# EAGLE design LightSwitch-USB (EAGLE 8.1.0)
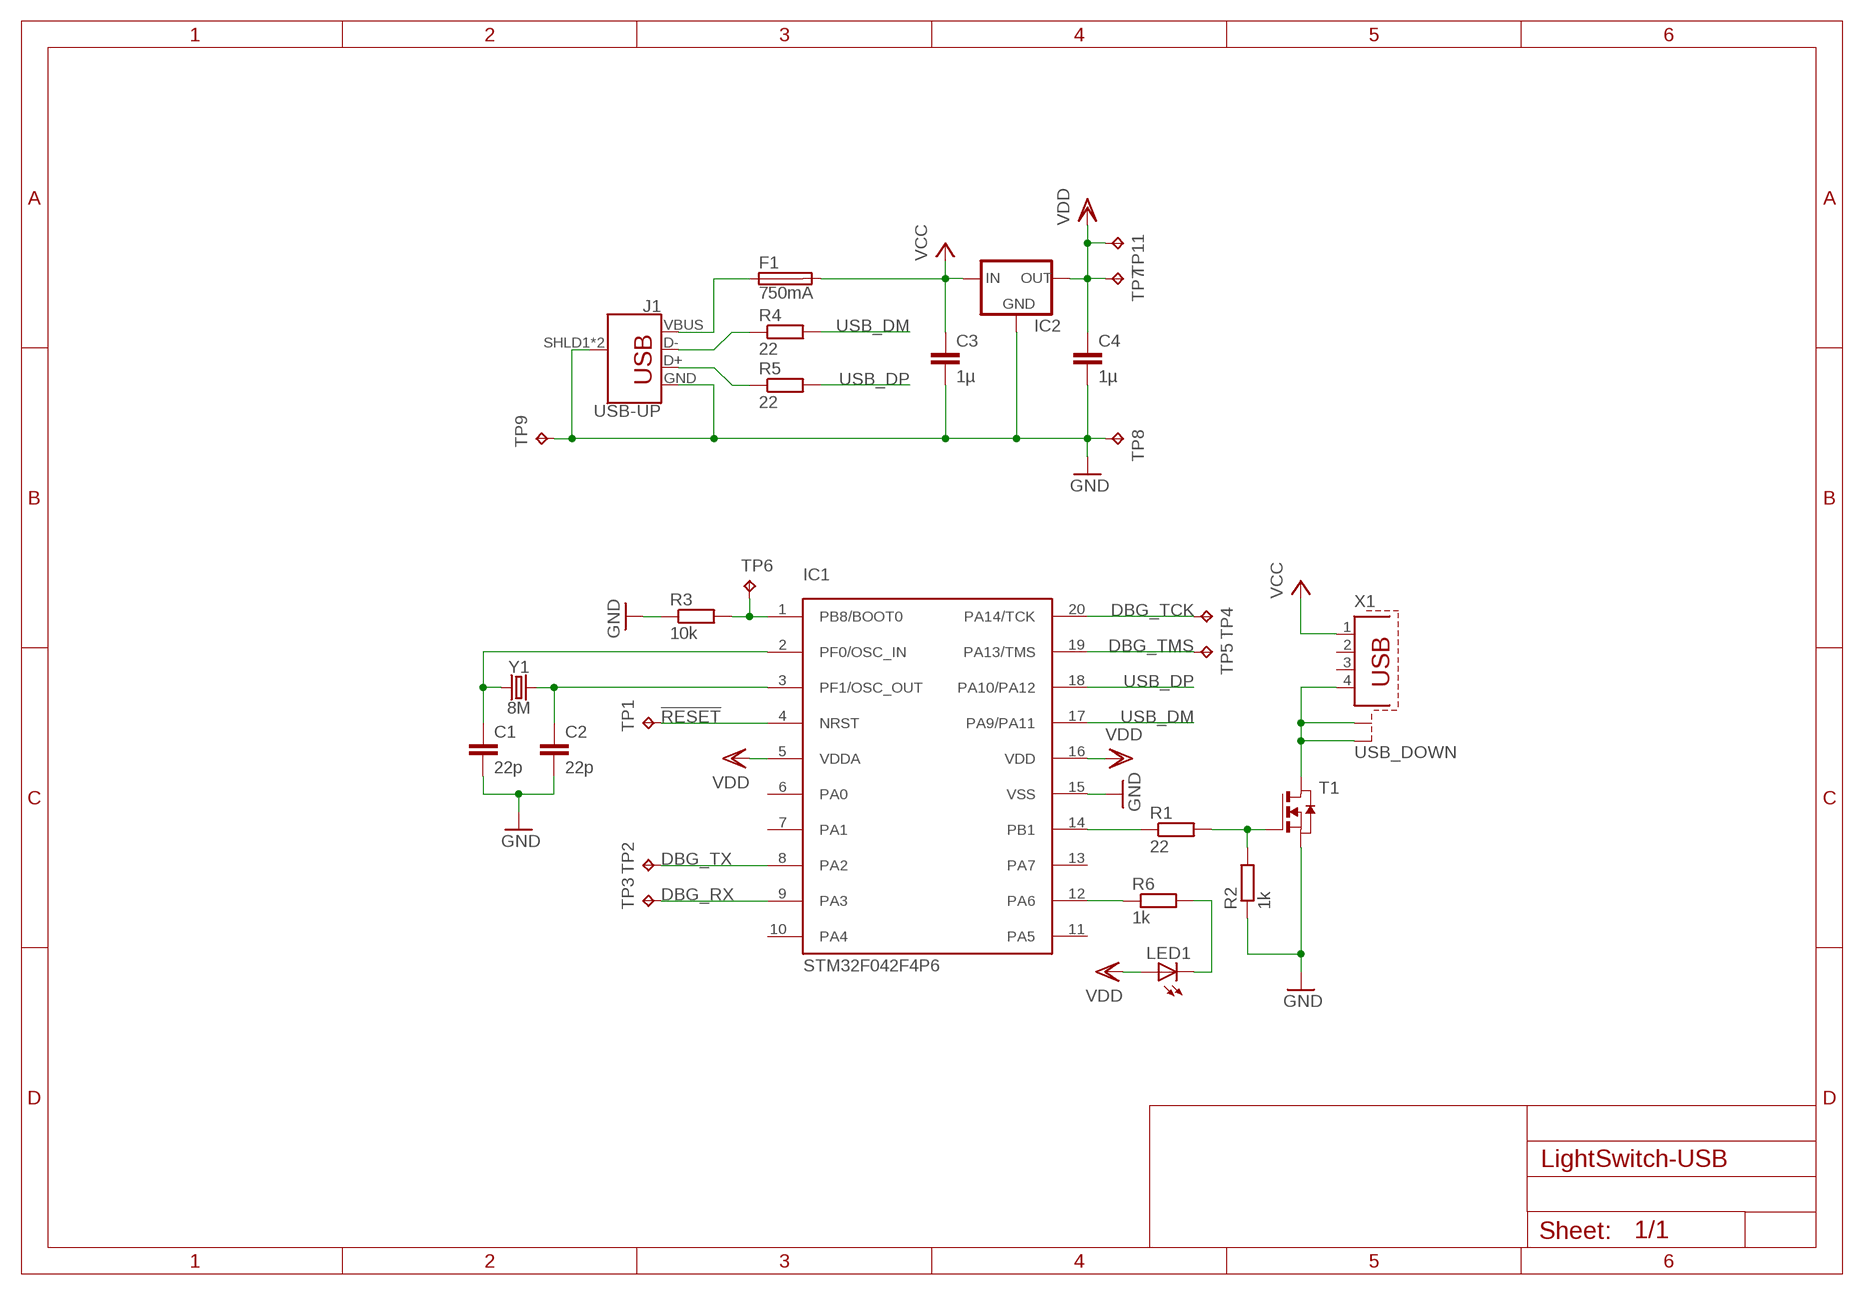
[diagram p0: schematic, sheet 1]

## Parts
C1  22p  C-EUC0603  [C0603]
C2  22p  C-EUC0603  [C0603]
C3  1µ  C-EUC0603  [C0603]
C4  1µ  C-EUC0603  [C0603]
F1  750mA  FUSER1206  [R1206]
IC1  STM32F042F4P6  [TSSOP20]
IC2  XC63FPM  [SOT23]
J1  USB-UP  USB_A_PTH_MALE  [USB-A-H]
LED1  LEDCHIP-LED0805  [CHIP-LED0805]
R1  22  R-EU_R0603  [R0603]
R2  1k  R-EU_R0603  [R0603]
R3  10k  R-EU_R0603  [R0603]
R4  22  R-EU_R0603  [R0603]
R5  22  R-EU_R0603  [R0603]
R6  1k  R-EU_R0603  [R0603]
T1  NMOSSOT23  [SOT-23]
TP1  TPB1,27  [B1,27]
TP2  TPB1,27  [B1,27]
TP3  TPB1,27  [B1,27]
TP4  TPB1,27  [B1,27]
TP5  TPB1,27  [B1,27]
TP6  TPB1,27  [B1,27]
TP7  TPB1,27  [B1,27]
TP8  TPB1,27  [B1,27]
TP9  TPB1,27  [B1,27]
TP11  TPB1,27  [B1,27]
X1  USB_DOWN  PN87520-S  [PN87520-S]
Y1  8M  CRYSTALSMD-5X3.2-2PAD  [CRYSTAL-SMD-5X3.2-2PAD]

## Nets
!RESET: IC1.4(NRST) TP1.TP
DBG_RX: IC1.9(PA3) TP3.TP
DBG_TCK: IC1.20(PA14/TCK) TP4.TP
DBG_TMS: IC1.19(PA13/TMS) TP5.TP
DBG_TX: IC1.8(PA2) TP2.TP
GND: C1.2 C2.2 C3.2 C4.2 IC1.15(VSS) IC2.1(GND) J1.GND J1.SHLD1(SHIELD) J1.SHLD2(SHIELD) R2.1 R3.1 T1.2(S) TP8.TP TP9.TP
N$1: T1.1(D) X1.4 X1.S1 X1.S2
N$2: LED1.C R6.2
N$3: IC1.12(PA6) R6.1
OUT_DRV: IC1.14(PB1) R1.1
OUT_GATE: R1.2 R2.2 T1.3(G)
SYS_BOOT: IC1.1(PB8/BOOT0) R3.2 TP6.TP
SYS_XIN: C1.1 IC1.2(PF0/OSC_IN) Y1.P$1
SYS_XOUT: C2.1 IC1.3(PF1/OSC_OUT) Y1.P$2
USB+: J1.D+ R5.1
USB-: J1.D- R4.1
USB_DM: IC1.17(PA9/PA11) R4.2
USB_DP: IC1.18(PA10/PA12) R5.2
VBUS: F1.1 J1.VBUS
VCC: C3.1 F1.2 IC2.3(IN) X1.1
VDD: C4.1 IC1.5(VDDA) IC1.16(VDD) IC2.2(OUT) LED1.A TP7.TP TP11.TP
Unconnected: IC1.6(PA0) IC1.7(PA1) IC1.10(PA4) IC1.11(PA5) IC1.13(PA7) X1.2 X1.3

## Library data of the parts
C1-C4 = rcl:C-EU: CAPACITOR, European symbol
F1 = fuse:FUSE: Fuse
IC1 = SushiBitsTablet:STM32F042F*?6
IC2 = v-reg:XC63FP: Positiv Voltage Regulators www.torex.co.jp/english/product/pro02/pdf/0201_xc62fp.pdf
J1 = SparkFun-Connectors:USB_A: USB-A Connector Male and female variants, as well as PTH and SMT variants SparkFun Products: SparkFun XBee Explorer Dongle <https://www.sparkfun.com/products/11697> PTH Male SparkFun MicroView-USB Programmer <https://www.sparkfun.com/products/12924> SMT Male SparkFun USB Type A Female Breakout <https://www.sparkfun.com/products/12700> SMT Female; PROD_ID: CONN-08367; SF_ID: PRT-00437
LED1 = led:LED: LED OSRAM: - CHIPLED LG R971, LG N971, LY N971, LG Q971, LY Q971, LO R971, LY R971 LH N974, LH R974 LS Q976, LO Q976, LY Q976 LO Q996 - Hyper CHIPLED LW Q18S LB Q993, LB Q99A, LB R99A - SideLED LS A670, LO A670, LY A670, LG A670, LP A670 LB A673, LV A673, LT A673, LW A673 LH A674 LY A675 LS A676, LA A676, LO A676, LY A676, LW A676 LS A679, LY A679, LG A679 - Hyper Micro SIDELED® LS Y876, LA Y876, LO Y876, LY Y876 LT Y87S - SmartLED LW L88C, LW L88S LB L89C, LB L89S, LG L890 LS L89K, LO L89K, LY L89K LS L896, LA L896, LO L896, LY L896 - TOPLED LS T670, LO T670, LY T670, LG T670, LP T670 LSG T670, LSP T670, LSY T670, LOP T670, LYG T670 LG T671, LOG T671, LSG T671 LB T673, LV T673, LT T673, LW T673 LH T674 LS T676, LA T676, LO T676, LY T676, LB T676, LH T676, LSB T676, LW T676 LB T67C, LV T67C, LT T67C, LS T67K, LO T67K, LY T67K, LW E67C LS E67B, LA E67B, LO E67B, LY E67B, LB E67C, LV E67C, LT E67C LW T67C LS T679, LY T679, LG T679 LS T770, LO T770, LY T770, LG T770, LP T770 LB T773, LV T773, LT T773, LW T773 LH T774 LS E675, LA E675, LY E675, LS T675 LS T776, LA T776, LO T776, LY T776, LB T776 LHGB T686 LT T68C, LB T68C - Hyper Mini TOPLED® LB M676 - Mini TOPLED Santana® LG M470 LS M47K, LO M47K, LY M47K Source: http://www.osram.convergy.de LUXEON: - LUMILED® LXK2-PW12-R00, LXK2-PW12-S00, LXK2-PW14-U00, LXK2-PW14-V00 LXK2-PM12-R00, LXK2-PM12-S00, LXK2-PM14-U00 LXK2-PE12-Q00, LXK2-PE12-R00, LXK2-PE12-S00, LXK2-PE14-T00, LXK2-PE14-U00 LXK2-PB12-K00, LXK2-PB12-L00, LXK2-PB12-M00, LXK2-PB14-N00, LXK2-PB14-P00, LXK2-PB14-Q00 LXK2-PR12-L00, LXK2-PR12-M00, LXK2-PR14-Q00, LXK2-PR14-R00 LXK2-PD12-Q00, LXK2-PD12-R00, LXK2-PD12-S00 LXK2-PH12-R00, LXK2-PH12-S00 LXK2-PL12-P00, LXK2-PL12-Q00, LXK2-PL12-R00 Source: www.luxeon.com KINGBRIGHT: KA-3528ASYC Source: www.kingbright.com
R1-R6 = rcl:R-EU_: RESISTOR, European symbol
T1 = zetex:NMOSSOT23: MOS FET; OC_FARNELL: unknown; OC_NEWARK: unknown
TP1-TP9 TP11 = testpad:TP: Test pad
X1 = con-berg:PN87520-S; OC_FARNELL: unknown; OC_NEWARK: unknown
Y1 = SparkFun-Clocks:CRYSTAL: Crystals (Generic) These are passive quartz crystals, which can be used as a clock source for a microcontroller. Crystal's are two-terminal devices. They require external "load" capacitors to generate an oscillating signal.

## Board
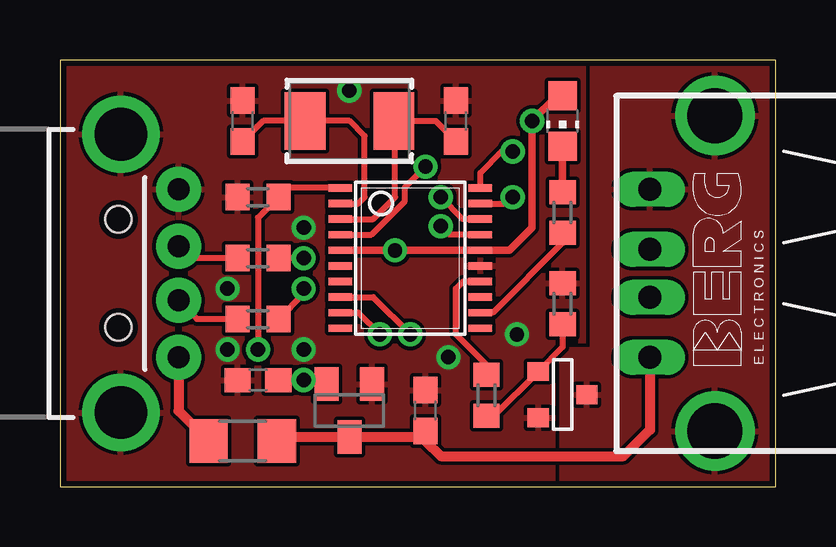
[diagram p1: board, top side]
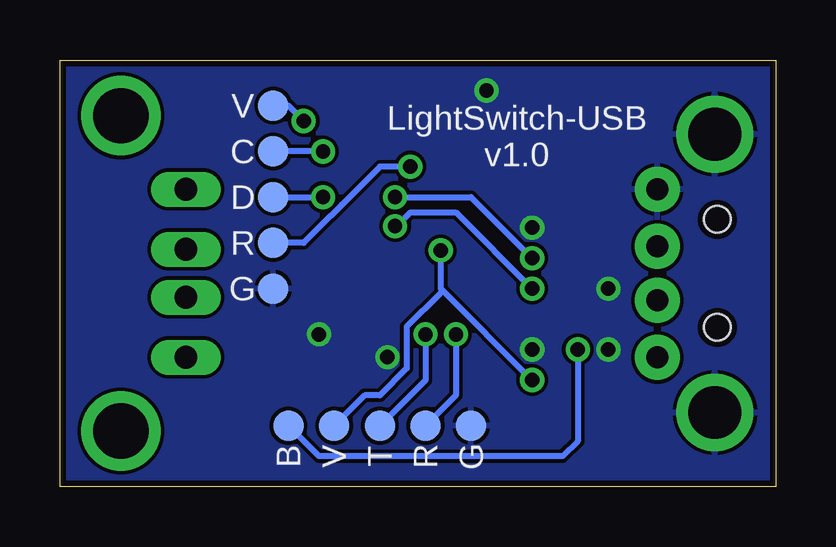
[diagram p2: board, bottom side, seen from below]

Size 29.84 x 17.78 mm. Coordinates in mm from the lower left corner, seen from the top.
Outline: 0,0 29.84,0 29.84,17.78 0,17.78 0,0
Copper layers (1*16): Top 0.035mm / dielectric 1.5mm / Bottom 0.035mm
Design rules "default *": minimum track width 6mil, minimum drill 0.3mm, track to track 6mil, track to pad 6mil, pad to pad 6mil, via to via 6mil, smd to smd 6mil, copper to edge 10mil, drill to drill 8mil, minimum pad ring 10mil, minimum via ring 8mil, stop-mask expansion 4mil, vias tented up to drill 0mil, thermal gap 6mil

### Footprints (pad centres in the part's own frame; a part is rotated, then mirrored left to right if it is on the bottom)
C0603 = smd 1.1 x 1: 1 -0.85,0; 2 0.85,0
R1206 = smd 1.6 x 1.803: 1 -1.422,0; 2 1.422,0
TSSOP20 = smd 0.305 x 0.991: 1 -2.925,-2.918; 2 -2.275,-2.918; 3 -1.625,-2.918; 4 -0.975,-2.918; 5 -0.325,-2.918; 6 0.325,-2.918; 7 0.975,-2.918; 8 1.625,-2.918; 9 2.275,-2.918; 10 2.925,-2.918; 11 2.925,2.918; 12 2.275,2.918; 13 1.625,2.918; 14 0.975,2.918; 15 0.325,2.918; 16 -0.325,2.918; 17 -0.975,2.918; 18 -1.625,2.918; 19 -2.275,2.918; 20 -2.925,2.918
SOT23 = smd 1 x 1.4: 1 -0.95,-1.1; 2 0.95,-1.1; 3 0,1.1
USB-A-H = drill 0.914 pad 1.88: D+ 2.4,1.127; D- 2.4,-1.127; GND 2.4,3.5; VBUS 2.4,-3.5 | drill 2.2: SHLD1 0,-5.8; SHLD2 0,5.8 | hole 1.1: -0.1,2.25; -0.1,-2.25
CHIP-LED0805 = smd 1.2 x 1.2: A 0,-1.05; C 0,1.05
R0603 = smd 1 x 1.1: 1 -0.85,0; 2 0.85,0
SOT-23 = smd 0.787 x 0.889: 1 0.025,-1.016; 2 -0.94,1.016; 3 0.991,1.016
B1,27 = smd 1.27 x 1.27: TP 0,0
PN87520-S = drill 0.95 long: 1 -3.5,2.71; 2 -1,2.71; 3 1,2.71; 4 3.5,2.71 | drill 2.3 pad 2.9: S1 -6.57,0; S2 6.57,0
CRYSTAL-SMD-5X3.2-2PAD = smd 1.7 x 2.4: P$1 1.85,0; P$2 -1.85,0

### Placement (x,y rotation side)
C1  7.62,15.24 90 top
C2  16.51,15.24 90 top
C3  15.24,3.17 90 top
C4  8.26,4.45 180 top
F1  7.62,1.91 0 top
IC1  14.61,9.53 270 top
IC2  12.06,3.17 180 top
J1  2.54,8.89 0 top
LED1  20.95,15.24 180 top
R1  17.78,3.81 270 top
R2  20.95,7.62 270 top
R3  8.26,12.06 0 top
R4  8.26,6.99 0 top
R5  8.26,9.53 0 top
R6  20.95,11.43 90 top
T1  20.95,3.81 90 top
TP1  20.95,10.16 0 bottom
TP2  16.51,2.54 0 bottom
TP3  14.61,2.54 0 bottom
TP4  20.95,13.97 0 bottom
TP5  20.95,12.06 0 bottom
TP6  20.32,2.54 0 bottom
TP7  20.95,15.88 0 bottom
TP8  20.95,8.26 0 bottom
TP9  12.7,2.54 0 bottom
TP11  18.41,2.54 0 bottom
X1  27.3,8.89 90 top
Y1  12.06,15.24 180 top

### Tracks (layer width: path | path; a pad name or v marks a point on that pad's centre or on a via)
!RESET  (via drill 0.6)
  Top 0.254: v15.24,13.34 14.38,12.47 14.38,11.9 12.98,10.5 IC1.4
  Bottom 0.254: v15.24,13.34 16.51,13.34 18.09,11.75 18.09,11.74 18.55,11.28 18.56,11.28 19.68,10.16 TP1.TP
DBG_RX  (via drill 0.6)
  Top 0.254: IC1.9 12.44,7.25 v13.34,6.35
  Bottom 0.254: v13.34,6.35 13.34,3.81 TP3.TP
DBG_TCK  (via drill 0.6)
  Top 0.254: IC1.20 17.52,13.08 18.41,13.97 v18.88,13.97
  Bottom 0.254: v18.88,13.97 TP4.TP
DBG_TMS  (via drill 0.6)
  Top 0.254: v18.88,12.06 18.61,11.8 IC1.19
  Bottom 0.254: TP5.TP v18.88,12.06
DBG_TX  (via drill 0.6)
  Top 0.254: IC1.8 13.05,7.9 v14.61,6.35
  Bottom 0.254: v14.61,6.35 14.61,4.45 TP2.TP
GND  (via drill 0.6)
  other vias: 19.05,6.35 16.19,5.4 12.06,16.51 10.16,10.79 6.99,8.26 6.99,5.71 10.16,5.71
  pour Bottom: 0,0 29.84,0 29.84,17.78 0,17.78
  pour Top (rank 6): 0,0 29.84,0 29.84,17.78 0,17.78
N$1
  pour Top (rank 5): 29.84,17.78 29.84,0 20.95,0 20.95,5.71 22.23,5.71 22.23,17.78
N$2
  Top 0.305: LED1.C R6.2
N$3
  Top 0.254: IC1.12 18.05,7.25 20.95,10.16 R6.1
OUT_DRV
  Top 0.254: IC1.14 16.8,8.55 16.51,8.26 16.51,6.35 17.78,5.08 R1.1
OUT_GATE
  Top 0.254: R1.2 18.1,2.96 T1.3 20.95,5.82 R2.2
SYS_BOOT  (via drill 0.6)
  Top 0.254: IC1.1 9.49,12.45 R3.2 8.26,11.21 v8.26,5.71
  Bottom 0.254: v8.26,5.71 8.26,1.91 8.89,1.27 19.05,1.27 TP6.TP
SYS_XIN
  Top 0.254: IC1.2 12.44,11.8 12.7,12.06 12.7,14.61 12.06,15.24 Y1.P$1 8.47,15.24 C1.1
SYS_XOUT
  Top 0.254: IC1.3 13.05,11.15 13.97,12.06 13.97,15.19 Y1.P$2 15.66,15.24 C2.1
USB+
  Top 0.254: R5.1 5.43,9.53 J1.D+
USB-
  Top 0.254: R4.1 5.72,6.99 J1.D-
USB_DM  (via drill 0.6)
  Top 0.254: IC1.17 16.23,10.5 v15.88,10.86 | v10.16,8.26 10.16,8.04 R4.2
  Bottom 0.254: v15.88,10.86 15.81,10.86 15.24,11.43 13.34,11.43 v10.16,8.26
USB_DP  (via drill 0.6)
  Top 0.254: IC1.18 16.79,11.15 v15.88,12.06 | v10.16,9.53 R5.2
  Bottom 0.254: v15.88,12.06 12.7,12.06 v10.16,9.53
VBUS
  Top 0.406: J1.VBUS 4.94,3.16 F1.1
VCC
  Top 0.406: F1.2 9.21,2.08 IC2.3 14.99,2.08 C3.1 15.24,1.91 15.88,1.27 23.5,1.27 24.59,2.37 X1.1
VDD  (via drill 0.6)
  Top 0.305: IC1.5 v13.97,9.85 IC1.16 18.74,9.85 19.68,10.79 v19.68,15.24 20.73,16.29 LED1.A | C4.1 v10.16,4.45 10.95,4.45 IC2.2
  Bottom 0.254: 13.97,8.26 v13.97,9.85 | 13.97,8.26 v10.16,4.45 | 13.97,8.26 13.97,8.09 15.39,6.67 15.39,4.93 16.51,3.81 17.14,3.81 TP11.TP | TP7.TP 20.32,15.88 v19.68,15.24

### Text on the board
bPlace: V | LightSwitch-USB / v1.0 | C | D | R | G | G | R | T | V | B